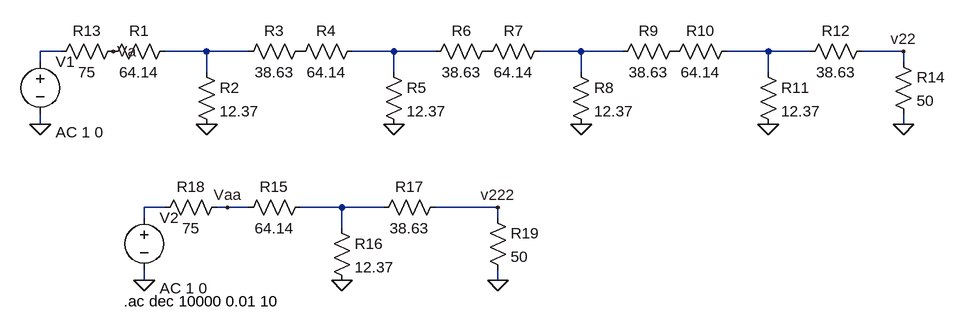
[diagram p0: schematic 80db.asc]
80db.asc, the LTspice schematic file:
Version 4
SHEET 1 1496 680
WIRE 128 128 96 128
WIRE 352 128 288 128
WIRE 416 128 352 128
WIRE 640 128 576 128
WIRE 704 128 640 128
WIRE 928 128 864 128
WIRE 992 128 928 128
WIRE 1216 128 1152 128
WIRE 1280 128 1216 128
WIRE 1424 128 1360 128
WIRE 96 144 96 128
WIRE 1424 144 1424 128
WIRE 352 160 352 128
WIRE 640 160 640 128
WIRE 928 160 928 128
WIRE 1216 160 1216 128
WIRE 96 240 96 224
WIRE 1424 240 1424 224
WIRE 288 368 256 368
WIRE 384 368 368 368
WIRE 416 368 384 368
WIRE 560 368 496 368
WIRE 624 368 560 368
WIRE 800 368 704 368
WIRE 256 384 256 368
WIRE 800 384 800 368
WIRE 560 400 560 368
WIRE 256 480 256 464
WIRE 800 480 800 464
FLAG 560 480 0
FLAG 256 480 0
FLAG 800 480 0
FLAG 352 240 0
FLAG 640 240 0
FLAG 928 240 0
FLAG 1216 240 0
FLAG 96 240 0
FLAG 1424 240 0
FLAG 208 128 Va
FLAG 384 368 Vaa
FLAG 1424 128 v22
FLAG 800 368 v222
SYMBOL res 512 352 R90
WINDOW 0 0 56 VBottom 2
WINDOW 3 32 56 VTop 2
SYMATTR InstName R15
SYMATTR Value 64.14
SYMBOL res 544 384 R0
SYMATTR InstName R16
SYMATTR Value 12.37
SYMBOL res 720 352 R90
WINDOW 0 0 56 VBottom 2
WINDOW 3 32 56 VTop 2
SYMATTR InstName R17
SYMATTR Value 38.63
SYMBOL res 384 352 R90
WINDOW 0 0 56 VBottom 2
WINDOW 3 32 56 VTop 2
SYMATTR InstName R18
SYMATTR Value 75
SYMBOL voltage 256 368 R0
WINDOW 123 24 124 Left 2
WINDOW 39 0 0 Left 0
SYMATTR Value2 AC 1 0
SYMATTR InstName V2
SYMATTR Value ""
SYMBOL res 784 368 R0
SYMATTR InstName R19
SYMATTR Value 50
SYMBOL res 304 112 R90
WINDOW 0 0 56 VBottom 2
WINDOW 3 32 56 VTop 2
SYMATTR InstName R1
SYMATTR Value 64.14
SYMBOL res 336 144 R0
SYMATTR InstName R2
SYMATTR Value 12.37
SYMBOL res 512 112 R90
WINDOW 0 0 56 VBottom 2
WINDOW 3 32 56 VTop 2
SYMATTR InstName R3
SYMATTR Value 38.63
SYMBOL res 592 112 R90
WINDOW 0 0 56 VBottom 2
WINDOW 3 32 56 VTop 2
SYMATTR InstName R4
SYMATTR Value 64.14
SYMBOL res 624 144 R0
SYMATTR InstName R5
SYMATTR Value 12.37
SYMBOL res 800 112 R90
WINDOW 0 0 56 VBottom 2
WINDOW 3 32 56 VTop 2
SYMATTR InstName R6
SYMATTR Value 38.63
SYMBOL res 880 112 R90
WINDOW 0 0 56 VBottom 2
WINDOW 3 32 56 VTop 2
SYMATTR InstName R7
SYMATTR Value 64.14
SYMBOL res 912 144 R0
SYMATTR InstName R8
SYMATTR Value 12.37
SYMBOL res 1088 112 R90
WINDOW 0 0 56 VBottom 2
WINDOW 3 32 56 VTop 2
SYMATTR InstName R9
SYMATTR Value 38.63
SYMBOL res 1168 112 R90
WINDOW 0 0 56 VBottom 2
WINDOW 3 32 56 VTop 2
SYMATTR InstName R10
SYMATTR Value 64.14
SYMBOL res 1200 144 R0
SYMATTR InstName R11
SYMATTR Value 12.37
SYMBOL res 1376 112 R90
WINDOW 0 0 56 VBottom 2
WINDOW 3 32 56 VTop 2
SYMATTR InstName R12
SYMATTR Value 38.63
SYMBOL res 224 112 R90
WINDOW 0 0 56 VBottom 2
WINDOW 3 32 56 VTop 2
SYMATTR InstName R13
SYMATTR Value 75
SYMBOL voltage 96 128 R0
WINDOW 123 24 124 Left 2
WINDOW 39 0 0 Left 0
SYMATTR Value2 AC 1 0
SYMATTR InstName V1
SYMATTR Value ""
SYMBOL res 1408 128 R0
SYMATTR InstName R14
SYMATTR Value 50
TEXT 224 512 Left 2 !.ac dec 10000 0.01 10

The netlist it stands for:
* 80db.asc
R15 N007 Vaa 64.14
R16 N007 0 12.37
R17 v222 N007 38.63
R18 Vaa N006 75
V2 N006 0 AC 1 0
R19 v222 0 50
R1 N002 Va 64.14
R2 N002 0 12.37
R3 P001 N002 38.63
R4 N003 P001 64.14
R5 N003 0 12.37
R6 P002 N003 38.63
R7 N004 P002 64.14
R8 N004 0 12.37
R9 P003 N004 38.63
R10 N005 P003 64.14
R11 N005 0 12.37
R12 v22 N005 38.63
R13 Va N001 75
V1 N001 0 AC 1 0
R14 v22 0 50
.ac dec 10000 0.01 10
.backanno
.end